# Altium schematic sheet 006_SoC Power.SchDoc
size 420 x 297 mm; Page Create Date: May 29, 2006; WebSite: https://www.seeedstudio.com; Page Number: 6; Drawing: qxn; Schematic Name: BeaglePlay; Page Size: A3; Comment: Seeed Title; Page Count: 22; Page Name: 006_SoC Power; Company: Seeed Studio; RevCode: v0.2; DsnPath: C:\Users\a0488739\Documents\GitHub\beagleplay\allegro\DVT\BEAGLEPLAYV020_220915.DSN; SchematicName: BeaglePlay; PageName: 006_SoC Power; PageSize: A3; TopSchematic: True
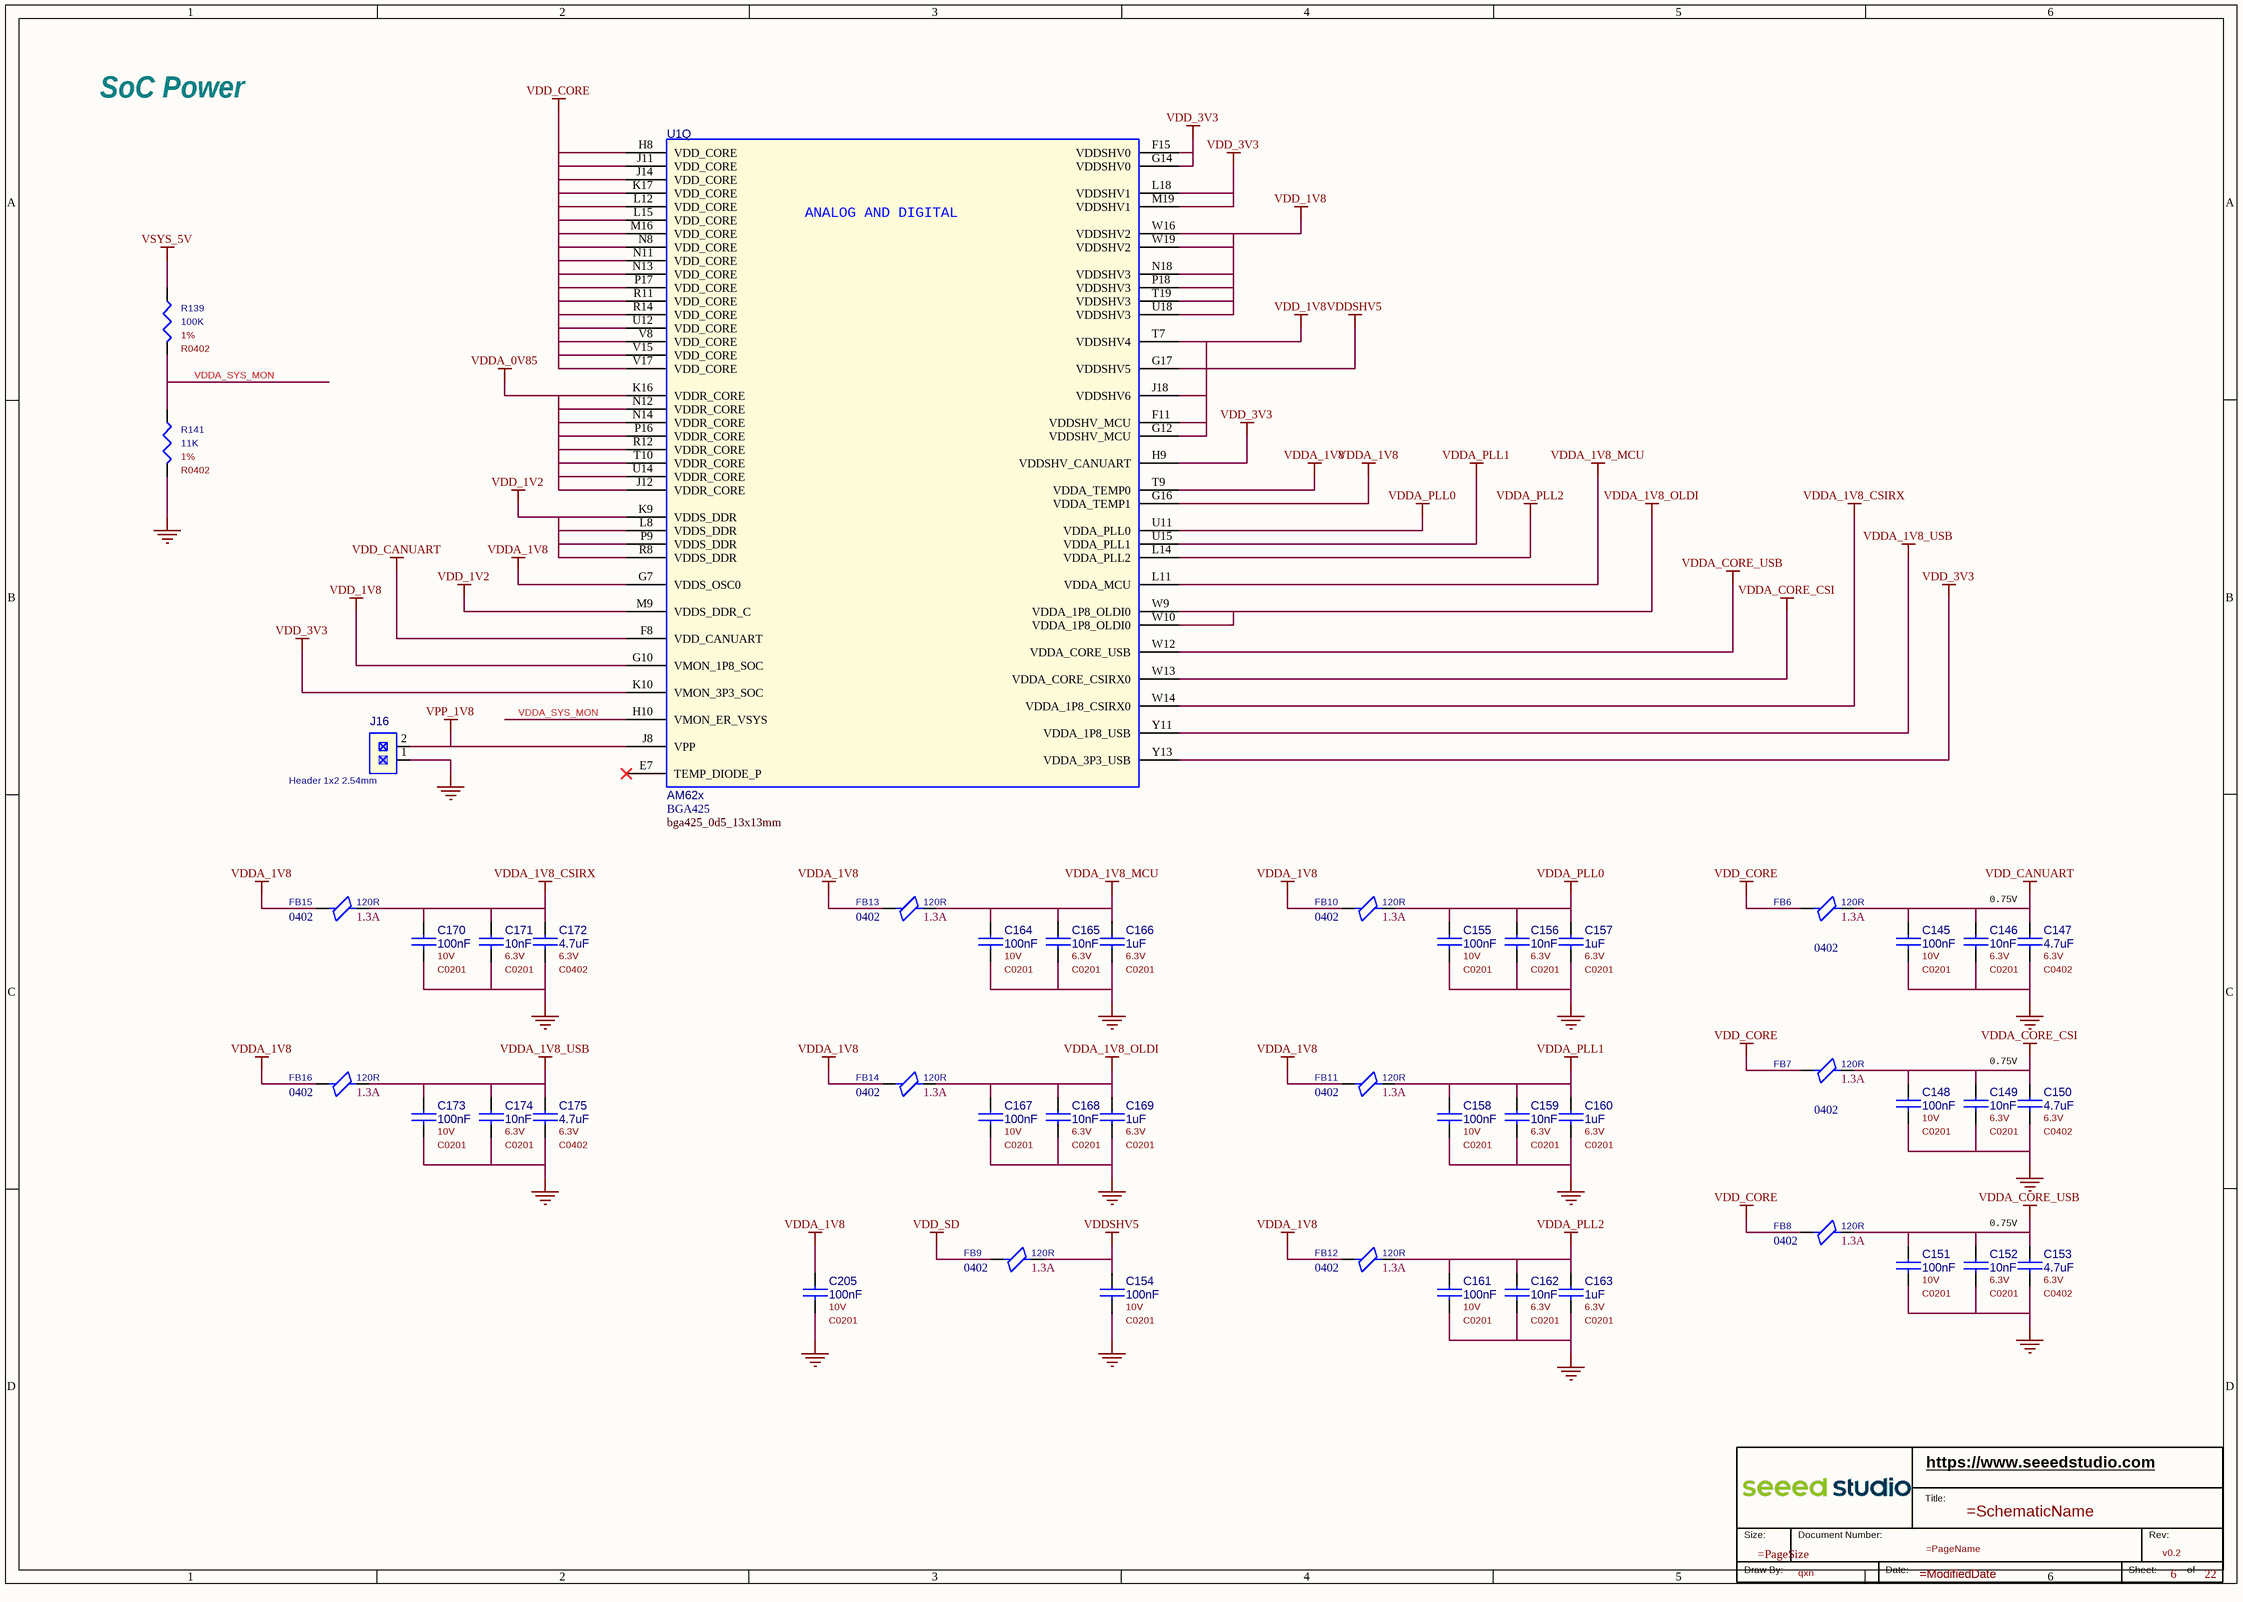
[diagram p0: 006_SoC Power.SchDoc]

## Parts
*  RevCode: v0.2  Page Number: 6  Page Count: 22  Drawing: qxn  (hidden comment: Seeed Title)  (graphical)
C145  value 100nF  Rating: 10V  [C0201]  (hidden comment: CC)
C146  value 10nF  Rating: 6.3V  [C0201]  (hidden comment: CC)
C147  value 4.7uF  Rating: 6.3V  [C0402]  (hidden comment: CC)
C148  value 100nF  Rating: 10V  [C0201]  (hidden comment: CC)
C149  value 10nF  Rating: 6.3V  [C0201]  (hidden comment: CC)
C150  value 4.7uF  Rating: 6.3V  [C0402]  (hidden comment: CC)
C151  value 100nF  Rating: 10V  [C0201]  (hidden comment: CC)
C152  value 10nF  Rating: 6.3V  [C0201]  (hidden comment: CC)
C153  value 4.7uF  Rating: 6.3V  [C0402]  (hidden comment: CC)
C154  value 100nF  Rating: 10V  [C0201]  (hidden comment: CC)
C155  value 100nF  Rating: 10V  [C0201]  (hidden comment: CC)
C156  value 10nF  Rating: 6.3V  [C0201]  (hidden comment: CC)
C157  value 1uF  Rating: 6.3V  [C0201]  (hidden comment: CC)
C158  value 100nF  Rating: 10V  [C0201]  (hidden comment: CC)
C159  value 10nF  Rating: 6.3V  [C0201]  (hidden comment: CC)
C160  value 1uF  Rating: 6.3V  [C0201]  (hidden comment: CC)
C161  value 100nF  Rating: 10V  [C0201]  (hidden comment: CC)
C162  value 10nF  Rating: 6.3V  [C0201]  (hidden comment: CC)
C163  value 1uF  Rating: 6.3V  [C0201]  (hidden comment: CC)
C164  value 100nF  Rating: 10V  [C0201]  (hidden comment: CC)
C165  value 10nF  Rating: 6.3V  [C0201]  (hidden comment: CC)
C166  value 1uF  Rating: 6.3V  [C0201]  (hidden comment: CC)
C167  value 100nF  Rating: 10V  [C0201]  (hidden comment: CC)
C168  value 10nF  Rating: 6.3V  [C0201]  (hidden comment: CC)
C169  value 1uF  Rating: 6.3V  [C0201]  (hidden comment: CC)
C170  value 100nF  Rating: 10V  [C0201]  (hidden comment: CC)
C171  value 10nF  Rating: 6.3V  [C0201]  (hidden comment: CC)
C172  value 4.7uF  Rating: 6.3V  [C0402]  (hidden comment: CC)
C173  value 100nF  Rating: 10V  [C0201]  (hidden comment: CC)
C174  value 10nF  Rating: 6.3V  [C0201]  (hidden comment: CC)
C175  value 4.7uF  Rating: 6.3V  [C0402]  (hidden comment: CC)
C205  value 100nF  Rating: 10V  [C0201]  (hidden comment: CC)
FB6  value 120R  Rating: 1.3A  Package Size: 0402  [L0402]  (hidden comment: FB)
FB7  value 120R  Rating: 1.3A  Package Size: 0402  [L0402]  (hidden comment: FB)
FB8  value 120R  Rating: 1.3A  Package Size: 0402  [L0402]  (hidden comment: FB)
FB9  value 120R  Rating: 1.3A  Package Size: 0402  [L0402]  (hidden comment: FB)
FB10  value 120R  Rating: 1.3A  Package Size: 0402  [L0402]  (hidden comment: FB)
FB11  value 120R  Rating: 1.3A  Package Size: 0402  [L0402]  (hidden comment: FB)
FB12  value 120R  Rating: 1.3A  Package Size: 0402  [L0402]  (hidden comment: FB)
FB13  value 120R  Rating: 1.3A  Package Size: 0402  [L0402]  (hidden comment: FB)
FB14  value 120R  Rating: 1.3A  Package Size: 0402  [L0402]  (hidden comment: FB)
FB15  value 120R  Rating: 1.3A  Package Size: 0402  [L0402]  (hidden comment: FB)
FB16  value 120R  Rating: 1.3A  Package Size: 0402  [L0402]  (hidden comment: FB)
J16  value Header 1x2 2.54mm  [header2p_2d54_dip]  (hidden comment: Header 1x2)
R139  value 100K  Rating: 1%  [R0402]  (hidden comment: R)
R141  value 11K  Rating: 1%  [R0402]  (hidden comment: R)
U1  value AM62x  Package Size: BGA425  [bga425_0d5_13x13mm]  (hidden comment: AM62x_BGA425)  (part Q of 19)

## Nets
GND: C145.2 C146.2 C147.2 C148.2 C149.2 C150.2 C151.2 C152.2 C153.2 C154.2 C155.2 C156.2 C157.2 C158.2 C159.2 C160.2 C161.2 C162.2 C163.2 C164.2 C165.2 C166.2 C167.2 C168.2 C169.2 C170.2 C171.2 C172.2 C173.2 C174.2 C175.2 C205.2 J16.1 R141.2
VDD_1V2: U1.K9(VDDS_DDR) U1.L8(VDDS_DDR) U1.M9(VDDS_DDR_C) U1.P9(VDDS_DDR) U1.R8(VDDS_DDR)
VDD_1V8: U1.F11(VDDSHV_MCU) U1.G10(VMON_1P8_SOC) U1.G12(VDDSHV_MCU) U1.J18(VDDSHV6) U1.N18(VDDSHV3) U1.P18(VDDSHV3) U1.T7(VDDSHV4) U1.T19(VDDSHV3) U1.U18(VDDSHV3) U1.W16(VDDSHV2) U1.W19(VDDSHV2)
VDD_3V3: U1.F15(VDDSHV0) U1.G14(VDDSHV0) U1.H9(VDDSHV_CANUART) U1.K10(VMON_3P3_SOC) U1.L18(VDDSHV1) U1.M19(VDDSHV1) U1.Y13(VDDA_3P3_USB)
VDD_CANUART: C145.1 C146.1 C147.1 FB6.2 U1.F8(VDD_CANUART)
VDD_CORE: FB6.1 FB7.1 FB8.1 U1.H8(VDD_CORE) U1.J11(VDD_CORE) U1.J14(VDD_CORE) U1.K17(VDD_CORE) U1.L12(VDD_CORE) U1.L15(VDD_CORE) U1.M16(VDD_CORE) U1.N8(VDD_CORE) U1.N11(VDD_CORE) U1.N13(VDD_CORE) U1.P17(VDD_CORE) U1.R11(VDD_CORE) U1.R14(VDD_CORE) U1.U12(VDD_CORE) U1.V8(VDD_CORE) U1.V15(VDD_CORE) U1.V17(VDD_CORE)
VDD_SD: FB9.1
VDDA_0V85: U1.J12(VDDR_CORE) U1.K16(VDDR_CORE) U1.N12(VDDR_CORE) U1.N14(VDDR_CORE) U1.P16(VDDR_CORE) U1.R12(VDDR_CORE) U1.T10(VDDR_CORE) U1.U14(VDDR_CORE)
VDDA_1V8: C205.1 FB10.1 FB11.1 FB12.1 FB13.1 FB14.1 FB15.1 FB16.1 U1.G7(VDDS_OSC0) U1.G16(VDDA_TEMP1) U1.T9(VDDA_TEMP0)
VDDA_1V8_CSIRX: C170.1 C171.1 C172.1 FB15.2 U1.W14(VDDA_1P8_CSIRX0)
VDDA_1V8_MCU: C164.1 C165.1 C166.1 FB13.2 U1.L11(VDDA_MCU)
VDDA_1V8_OLDI: C167.1 C168.1 C169.1 FB14.2 U1.W9(VDDA_1P8_OLDI0) U1.W10(VDDA_1P8_OLDI0)
VDDA_1V8_USB: C173.1 C174.1 C175.1 FB16.2 U1.Y11(VDDA_1P8_USB)
VDDA_CORE_CSI: C148.1 C149.1 C150.1 FB7.2 U1.W13(VDDA_CORE_CSIRX0)
VDDA_CORE_USB: C151.1 C152.1 C153.1 FB8.2 U1.W12(VDDA_CORE_USB)
VDDA_PLL0: C155.1 C156.1 C157.1 FB10.2 U1.U11(VDDA_PLL0)
VDDA_PLL1: C158.1 C159.1 C160.1 FB11.2 U1.U15(VDDA_PLL1)
VDDA_PLL2: C161.1 C162.1 C163.1 FB12.2 U1.L14(VDDA_PLL2)
VDDSHV5: C154.1 FB9.2 U1.G17(VDDSHV5)
VPP_1V8: J16.2 U1.J8(VPP)
VSYS_5V: R139.1
VDDA_SYS_MON: R139.2 R141.1 U1.H10(VMON_ER_VSYS)

Not connected (* = marked no-connect by the designer): U1 E7(TEMP_DIODE_P)*

## Notes on the sheet
- SoC Power
- 0.75V
- (in symbol AM62x_BGA425, part Q) ANALOG AND DIGITAL
- (in symbol Seeed Title) https://www.seeedstudio.com; Title:; Size:; Document Number:; Rev:; Draw By:; Date:; Sheet:; of

## Library data of the parts
* = Seeed Title: Company: Seeed Studio; WebSite: https://www.seeedstudio.com; Schematic Name: =SchematicName; Page Size: =PageSize; Page Name: =PageName; Page Create Date: May 29, 2006; Page Modify Date: =ModifiedDate
C145 = CC: CAP, Ceramic, SMD, 100nF, 10%, 10V, 0201; Part Reference: C145; Manufacturer PN: CC0201KRX5R6BB104; Manufacturer: YAGEO; Company Part Status: ODYSSEY-i.MX8M; CLASS: DISCRETE; Temperature Coefficient: X5R; PN: 302010271; PCB Footprint: C0201; Tolerance: 10%; Dielectric Type: Ceramic; Package Size: 0201
C146 = CC: CAP, Ceramic, SMD, 10nF, 10%, 6.3V, 0201; Part Reference: C146; Manufacturer PN: CC0201KRX5R5BB103; Manufacturer: YAGEO; Company Part Status: ODYSSEY-i.MX8M; CLASS: DISCRETE; Temperature Coefficient: X5R; PN: 302011831; PCB Footprint: C0201; Tolerance: 10%; Dielectric Type: Ceramic; Package Size: 0201
C147 = CC: CAP, Ceramic, SMD, 4.7uF, 20%, 6.3V, 0402; Part Reference: C147; Manufacturer PN: CC0402MRX5R5BB475; Manufacturer: YAGEO; Company Part Status: BeagleBone Carrier Board; CLASS: DISCRETE; Temperature Coefficient: X5R; PN: 302010019; PCB Footprint: C0402; Tolerance: 20%; Dielectric Type: Ceramic; Package Size: 0402
C148 = CC: CAP, Ceramic, SMD, 100nF, 10%, 10V, 0201; Part Reference: C148; Manufacturer PN: CC0201KRX5R6BB104; Manufacturer: YAGEO; Company Part Status: ODYSSEY-i.MX8M; CLASS: DISCRETE; Temperature Coefficient: X5R; PN: 302010271; PCB Footprint: C0201; Tolerance: 10%; Dielectric Type: Ceramic; Package Size: 0201
C149 = CC: CAP, Ceramic, SMD, 10nF, 10%, 6.3V, 0201; Part Reference: C149; Manufacturer PN: CC0201KRX5R5BB103; Manufacturer: YAGEO; Company Part Status: ODYSSEY-i.MX8M; CLASS: DISCRETE; Temperature Coefficient: X5R; PN: 302011831; PCB Footprint: C0201; Tolerance: 10%; Dielectric Type: Ceramic; Package Size: 0201
C150 = CC: CAP, Ceramic, SMD, 4.7uF, 20%, 6.3V, 0402; Part Reference: C150; Manufacturer PN: CC0402MRX5R5BB475; Manufacturer: YAGEO; Company Part Status: BeagleBone Carrier Board; CLASS: DISCRETE; Temperature Coefficient: X5R; PN: 302010019; PCB Footprint: C0402; Tolerance: 20%; Dielectric Type: Ceramic; Package Size: 0402
C151 = CC: CAP, Ceramic, SMD, 100nF, 10%, 10V, 0201; Part Reference: C151; Manufacturer PN: CC0201KRX5R6BB104; Manufacturer: YAGEO; Company Part Status: ODYSSEY-i.MX8M; CLASS: DISCRETE; Temperature Coefficient: X5R; PN: 302010271; PCB Footprint: C0201; Tolerance: 10%; Dielectric Type: Ceramic; Package Size: 0201
C152 = CC: CAP, Ceramic, SMD, 10nF, 10%, 6.3V, 0201; Part Reference: C152; Manufacturer PN: CC0201KRX5R5BB103; Manufacturer: YAGEO; Company Part Status: ODYSSEY-i.MX8M; CLASS: DISCRETE; Temperature Coefficient: X5R; PN: 302011831; PCB Footprint: C0201; Tolerance: 10%; Dielectric Type: Ceramic; Package Size: 0201
C153 = CC: CAP, Ceramic, SMD, 4.7uF, 20%, 6.3V, 0402; Part Reference: C153; Manufacturer PN: CC0402MRX5R5BB475; Manufacturer: YAGEO; Company Part Status: BeagleBone Carrier Board; CLASS: DISCRETE; Temperature Coefficient: X5R; PN: 302010019; PCB Footprint: C0402; Tolerance: 20%; Dielectric Type: Ceramic; Package Size: 0402
C154 = CC: CAP, Ceramic, SMD, 100nF, 10%, 10V, 0201; Part Reference: C154; Manufacturer PN: CC0201KRX5R6BB104; Manufacturer: YAGEO; Company Part Status: ODYSSEY-i.MX8M; CLASS: DISCRETE; Temperature Coefficient: X5R; PN: 302010271; PCB Footprint: C0201; Tolerance: 10%; Dielectric Type: Ceramic; Package Size: 0201
C155 = CC: CAP, Ceramic, SMD, 100nF, 10%, 10V, 0201; Part Reference: C155; Company Part Status: ODYSSEY-i.MX8M; Manufacturer: YAGEO; Manufacturer PN: CC0201KRX5R6BB104; PN: 302010271; Temperature Coefficient: X5R; CLASS: DISCRETE; PCB Footprint: C0201; Package Size: 0201; Dielectric Type: Ceramic; Tolerance: 10%
C156 = CC: CAP, Ceramic, SMD, 10nF, 10%, 6.3V, 0201; Part Reference: C156; Company Part Status: ODYSSEY-i.MX8M; Manufacturer: YAGEO; Manufacturer PN: CC0201KRX5R5BB103; PN: 302011831; Temperature Coefficient: X5R; CLASS: DISCRETE; PCB Footprint: C0201; Package Size: 0201; Dielectric Type: Ceramic; Tolerance: 10%
C157 = CC: CAP, Ceramic, SMD, 1uF, 20%, 6.3V, 0201; Part Reference: C157; Company Part Status: ODYSSEY-i.MX8M; Manufacturer: YAGEO; Manufacturer PN: CC0201MRX5R5BB105; PN: 302010270; Temperature Coefficient: X5R; CLASS: DISCRETE; PCB Footprint: C0201; Package Size: 0201; Dielectric Type: Ceramic; Tolerance: 20%
C158 = CC: CAP, Ceramic, SMD, 100nF, 10%, 10V, 0201; Part Reference: C158; Company Part Status: ODYSSEY-i.MX8M; Manufacturer: YAGEO; Manufacturer PN: CC0201KRX5R6BB104; PN: 302010271; Temperature Coefficient: X5R; CLASS: DISCRETE; PCB Footprint: C0201; Package Size: 0201; Dielectric Type: Ceramic; Tolerance: 10%
C159 = CC: CAP, Ceramic, SMD, 10nF, 10%, 6.3V, 0201; Part Reference: C159; Company Part Status: ODYSSEY-i.MX8M; Manufacturer: YAGEO; Manufacturer PN: CC0201KRX5R5BB103; PN: 302011831; Temperature Coefficient: X5R; CLASS: DISCRETE; PCB Footprint: C0201; Package Size: 0201; Dielectric Type: Ceramic; Tolerance: 10%
C160 = CC: CAP, Ceramic, SMD, 1uF, 20%, 6.3V, 0201; Part Reference: C160; Company Part Status: ODYSSEY-i.MX8M; Manufacturer: YAGEO; Manufacturer PN: CC0201MRX5R5BB105; PN: 302010270; Temperature Coefficient: X5R; CLASS: DISCRETE; PCB Footprint: C0201; Package Size: 0201; Dielectric Type: Ceramic; Tolerance: 20%
C161 = CC: CAP, Ceramic, SMD, 100nF, 10%, 10V, 0201; Part Reference: C161; Company Part Status: ODYSSEY-i.MX8M; Manufacturer: YAGEO; Manufacturer PN: CC0201KRX5R6BB104; PN: 302010271; Temperature Coefficient: X5R; CLASS: DISCRETE; PCB Footprint: C0201; Package Size: 0201; Dielectric Type: Ceramic; Tolerance: 10%
C162 = CC: CAP, Ceramic, SMD, 10nF, 10%, 6.3V, 0201; Part Reference: C162; Company Part Status: ODYSSEY-i.MX8M; Manufacturer: YAGEO; Manufacturer PN: CC0201KRX5R5BB103; PN: 302011831; Temperature Coefficient: X5R; CLASS: DISCRETE; PCB Footprint: C0201; Package Size: 0201; Dielectric Type: Ceramic; Tolerance: 10%
C163 = CC: CAP, Ceramic, SMD, 1uF, 20%, 6.3V, 0201; Part Reference: C163; Company Part Status: ODYSSEY-i.MX8M; Manufacturer: YAGEO; Manufacturer PN: CC0201MRX5R5BB105; PN: 302010270; Temperature Coefficient: X5R; CLASS: DISCRETE; PCB Footprint: C0201; Package Size: 0201; Dielectric Type: Ceramic; Tolerance: 20%
C164 = CC: CAP, Ceramic, SMD, 100nF, 10%, 10V, 0201; Part Reference: C164; Company Part Status: ODYSSEY-i.MX8M; Manufacturer: YAGEO; Manufacturer PN: CC0201KRX5R6BB104; PN: 302010271; Temperature Coefficient: X5R; CLASS: DISCRETE; PCB Footprint: C0201; Package Size: 0201; Dielectric Type: Ceramic; Tolerance: 10%
C165 = CC: CAP, Ceramic, SMD, 10nF, 10%, 6.3V, 0201; Part Reference: C165; Company Part Status: ODYSSEY-i.MX8M; Manufacturer: YAGEO; Manufacturer PN: CC0201KRX5R5BB103; PN: 302011831; Temperature Coefficient: X5R; CLASS: DISCRETE; PCB Footprint: C0201; Package Size: 0201; Dielectric Type: Ceramic; Tolerance: 10%
C166 = CC: CAP, Ceramic, SMD, 1uF, 20%, 6.3V, 0201; Part Reference: C166; Company Part Status: ODYSSEY-i.MX8M; Manufacturer: YAGEO; Manufacturer PN: CC0201MRX5R5BB105; PN: 302010270; Temperature Coefficient: X5R; CLASS: DISCRETE; PCB Footprint: C0201; Package Size: 0201; Dielectric Type: Ceramic; Tolerance: 20%
C167 = CC: CAP, Ceramic, SMD, 100nF, 10%, 10V, 0201; Part Reference: C167; Company Part Status: ODYSSEY-i.MX8M; Manufacturer: YAGEO; Manufacturer PN: CC0201KRX5R6BB104; PN: 302010271; Temperature Coefficient: X5R; CLASS: DISCRETE; PCB Footprint: C0201; Package Size: 0201; Dielectric Type: Ceramic; Tolerance: 10%
C168 = CC: CAP, Ceramic, SMD, 10nF, 10%, 6.3V, 0201; Part Reference: C168; Company Part Status: ODYSSEY-i.MX8M; Manufacturer: YAGEO; Manufacturer PN: CC0201KRX5R5BB103; PN: 302011831; Temperature Coefficient: X5R; CLASS: DISCRETE; PCB Footprint: C0201; Package Size: 0201; Dielectric Type: Ceramic; Tolerance: 10%
C169 = CC: CAP, Ceramic, SMD, 1uF, 20%, 6.3V, 0201; Part Reference: C169; Company Part Status: ODYSSEY-i.MX8M; Manufacturer: YAGEO; Manufacturer PN: CC0201MRX5R5BB105; PN: 302010270; Temperature Coefficient: X5R; CLASS: DISCRETE; PCB Footprint: C0201; Package Size: 0201; Dielectric Type: Ceramic; Tolerance: 20%
C170 = CC: CAP, Ceramic, SMD, 100nF, 10%, 10V, 0201; Part Reference: C170; Manufacturer PN: CC0201KRX5R6BB104; Manufacturer: YAGEO; Company Part Status: ODYSSEY-i.MX8M; CLASS: DISCRETE; Temperature Coefficient: X5R; PN: 302010271; PCB Footprint: C0201; Tolerance: 10%; Dielectric Type: Ceramic; Package Size: 0201
C171 = CC: CAP, Ceramic, SMD, 10nF, 10%, 6.3V, 0201; Part Reference: C171; Manufacturer PN: CC0201KRX5R5BB103; Manufacturer: YAGEO; Company Part Status: ODYSSEY-i.MX8M; CLASS: DISCRETE; Temperature Coefficient: X5R; PN: 302011831; PCB Footprint: C0201; Tolerance: 10%; Dielectric Type: Ceramic; Package Size: 0201
C172 = CC: CAP, Ceramic, SMD, 4.7uF, 20%, 6.3V, 0402; Part Reference: C172; Company Part Status: BeagleBone Carrier Board; Manufacturer: YAGEO; Manufacturer PN: CC0402MRX5R5BB475; PN: 302010019; Temperature Coefficient: X5R; CLASS: DISCRETE; PCB Footprint: C0402; Package Size: 0402; Dielectric Type: Ceramic; Tolerance: 20%
C173 = CC: CAP, Ceramic, SMD, 100nF, 10%, 10V, 0201; Part Reference: C173; Manufacturer PN: CC0201KRX5R6BB104; Manufacturer: YAGEO; Company Part Status: ODYSSEY-i.MX8M; CLASS: DISCRETE; Temperature Coefficient: X5R; PN: 302010271; PCB Footprint: C0201; Tolerance: 10%; Dielectric Type: Ceramic; Package Size: 0201
C174 = CC: CAP, Ceramic, SMD, 10nF, 10%, 6.3V, 0201; Part Reference: C174; Manufacturer PN: CC0201KRX5R5BB103; Manufacturer: YAGEO; Company Part Status: ODYSSEY-i.MX8M; CLASS: DISCRETE; Temperature Coefficient: X5R; PN: 302011831; PCB Footprint: C0201; Tolerance: 10%; Dielectric Type: Ceramic; Package Size: 0201
C175 = CC: CAP, Ceramic, SMD, 4.7uF, 20%, 6.3V, 0402; Part Reference: C175; Company Part Status: BeagleBone Carrier Board; Manufacturer: YAGEO; Manufacturer PN: CC0402MRX5R5BB475; PN: 302010019; Temperature Coefficient: X5R; CLASS: DISCRETE; PCB Footprint: C0402; Package Size: 0402; Dielectric Type: Ceramic; Tolerance: 20%
C205 = CC: CAP, Ceramic, SMD, 100nF, 10%, 10V, 0201; Part Reference: C205; Manufacturer PN: CC0201KRX5R6BB104; Manufacturer: YAGEO; Company Part Status: ODYSSEY-i.MX8M; CLASS: DISCRETE; Temperature Coefficient: X5R; PN: 302010271; PCB Footprint: C0201; Tolerance: 10%; Dielectric Type: Ceramic; Package Size: 0201
FB6 = FB: Ferrite Bead, 120R, , 1.3A, 0402; Part Reference: FB6; Company Part Status: BeagleBone Carrier Board; Manufacturer: Murata; Manufacturer PN: BLM15PD121SN1D; PN: 303030040; CLASS: DISCRETE; PCB Footprint: L0402
FB7 = FB: Ferrite Bead, 120R, , 1.3A, 0402; Part Reference: FB7; Company Part Status: BeagleBone Carrier Board; Manufacturer: Murata; Manufacturer PN: BLM15PD121SN1D; PN: 303030040; CLASS: DISCRETE; PCB Footprint: L0402
FB8 = FB: Ferrite Bead, 120R, , 1.3A, 0402; Part Reference: FB8; Manufacturer PN: BLM15PD121SN1D; Manufacturer: Murata; Company Part Status: BeagleBone Carrier Board; CLASS: DISCRETE; PN: 303030040; PCB Footprint: L0402
FB9 = FB: Ferrite Bead, 120R, , 1.3A, 0402; Part Reference: FB9; Company Part Status: BeagleBone Carrier Board; Manufacturer: Murata; Manufacturer PN: BLM15PD121SN1D; PN: 303030040; CLASS: DISCRETE; PCB Footprint: L0402
FB10 = FB: Ferrite Bead, 120R, , 1.3A, 0402; Part Reference: FB10; Company Part Status: BeagleBone Carrier Board; Manufacturer: Murata; Manufacturer PN: BLM15PD121SN1D; PN: 303030040; CLASS: DISCRETE; PCB Footprint: L0402
FB11 = FB: Ferrite Bead, 120R, , 1.3A, 0402; Part Reference: FB11; Company Part Status: BeagleBone Carrier Board; Manufacturer: Murata; Manufacturer PN: BLM15PD121SN1D; PN: 303030040; CLASS: DISCRETE; PCB Footprint: L0402
FB12 = FB: Ferrite Bead, 120R, , 1.3A, 0402; Part Reference: FB12; Company Part Status: BeagleBone Carrier Board; Manufacturer: Murata; Manufacturer PN: BLM15PD121SN1D; PN: 303030040; CLASS: DISCRETE; PCB Footprint: L0402
FB13 = FB: Ferrite Bead, 120R, , 1.3A, 0402; Part Reference: FB13; Company Part Status: BeagleBone Carrier Board; Manufacturer: Murata; Manufacturer PN: BLM15PD121SN1D; PN: 303030040; CLASS: DISCRETE; PCB Footprint: L0402
FB14 = FB: Ferrite Bead, 120R, , 1.3A, 0402; Part Reference: FB14; Company Part Status: BeagleBone Carrier Board; Manufacturer: Murata; Manufacturer PN: BLM15PD121SN1D; PN: 303030040; CLASS: DISCRETE; PCB Footprint: L0402
FB15 = FB: Ferrite Bead, 120R, , 1.3A, 0402; Part Reference: FB15; Manufacturer PN: BLM15PD121SN1D; Manufacturer: Murata; Company Part Status: BeagleBone Carrier Board; CLASS: DISCRETE; PN: 303030040; PCB Footprint: L0402
FB16 = FB: Ferrite Bead, 120R, , 1.3A, 0402; Part Reference: FB16; Manufacturer PN: BLM15PD121SN1D; Manufacturer: Murata; Company Part Status: BeagleBone Carrier Board; CLASS: DISCRETE; PN: 303030040; PCB Footprint: L0402
J16 = Header 1x2: CONN, Header, 1*2P, DIP; Part Reference: J16; Manufacturer PN: P125-1202A0BS116A1; Manufacturer: Yuxi Electronics; Company Part Status: BeagleBone Carrier Board; CLASS: IO; PN: 320020016; PCB Footprint: header2p_2d54_dip; Package Size: 1*2P-2.54-2.54-11.6/3.0mm
R139 = R: RES, Thick Film, 100K, 1%, 1/16W, SMD, 0402; Part Reference: R139; Manufacturer PN: RC0402FR-07100KL; Manufacturer: YAGEO; Company Part Status: BeagleBone Carrier Board; CLASS: DISCRETE; PN: 301010456; PCB Footprint: R0402; Rated Power: 1/16W; Package Size: 0402
R141 = R: RES, Thick Film, 11K, 1%, 1/16W, SMD, 0402; Part Reference: R141; Company Part Status: MS; Manufacturer: YAGEO; Manufacturer PN: RC0402FR-0711KL; PN: 301010568; Temperature Coefficient: 25 ppm; CLASS: DISCRETE; PCB Footprint: R0402; Package Size: 0402; Rated Power: 1/16W
U1 = AM62x_BGA425: IC, Controller, MPU, AM62x, BGA425; Part Reference: U1; Manufacturer PN: AM6254ATCGGHALWR; Manufacturer: TI; Company Part Status: BeaglePlay; PN: 310011537; PCB Footprint: bga425_0d5_13x13mm; CLASS: IC